# EAGLE schematic cerebellar (EAGLE 9.6.2)
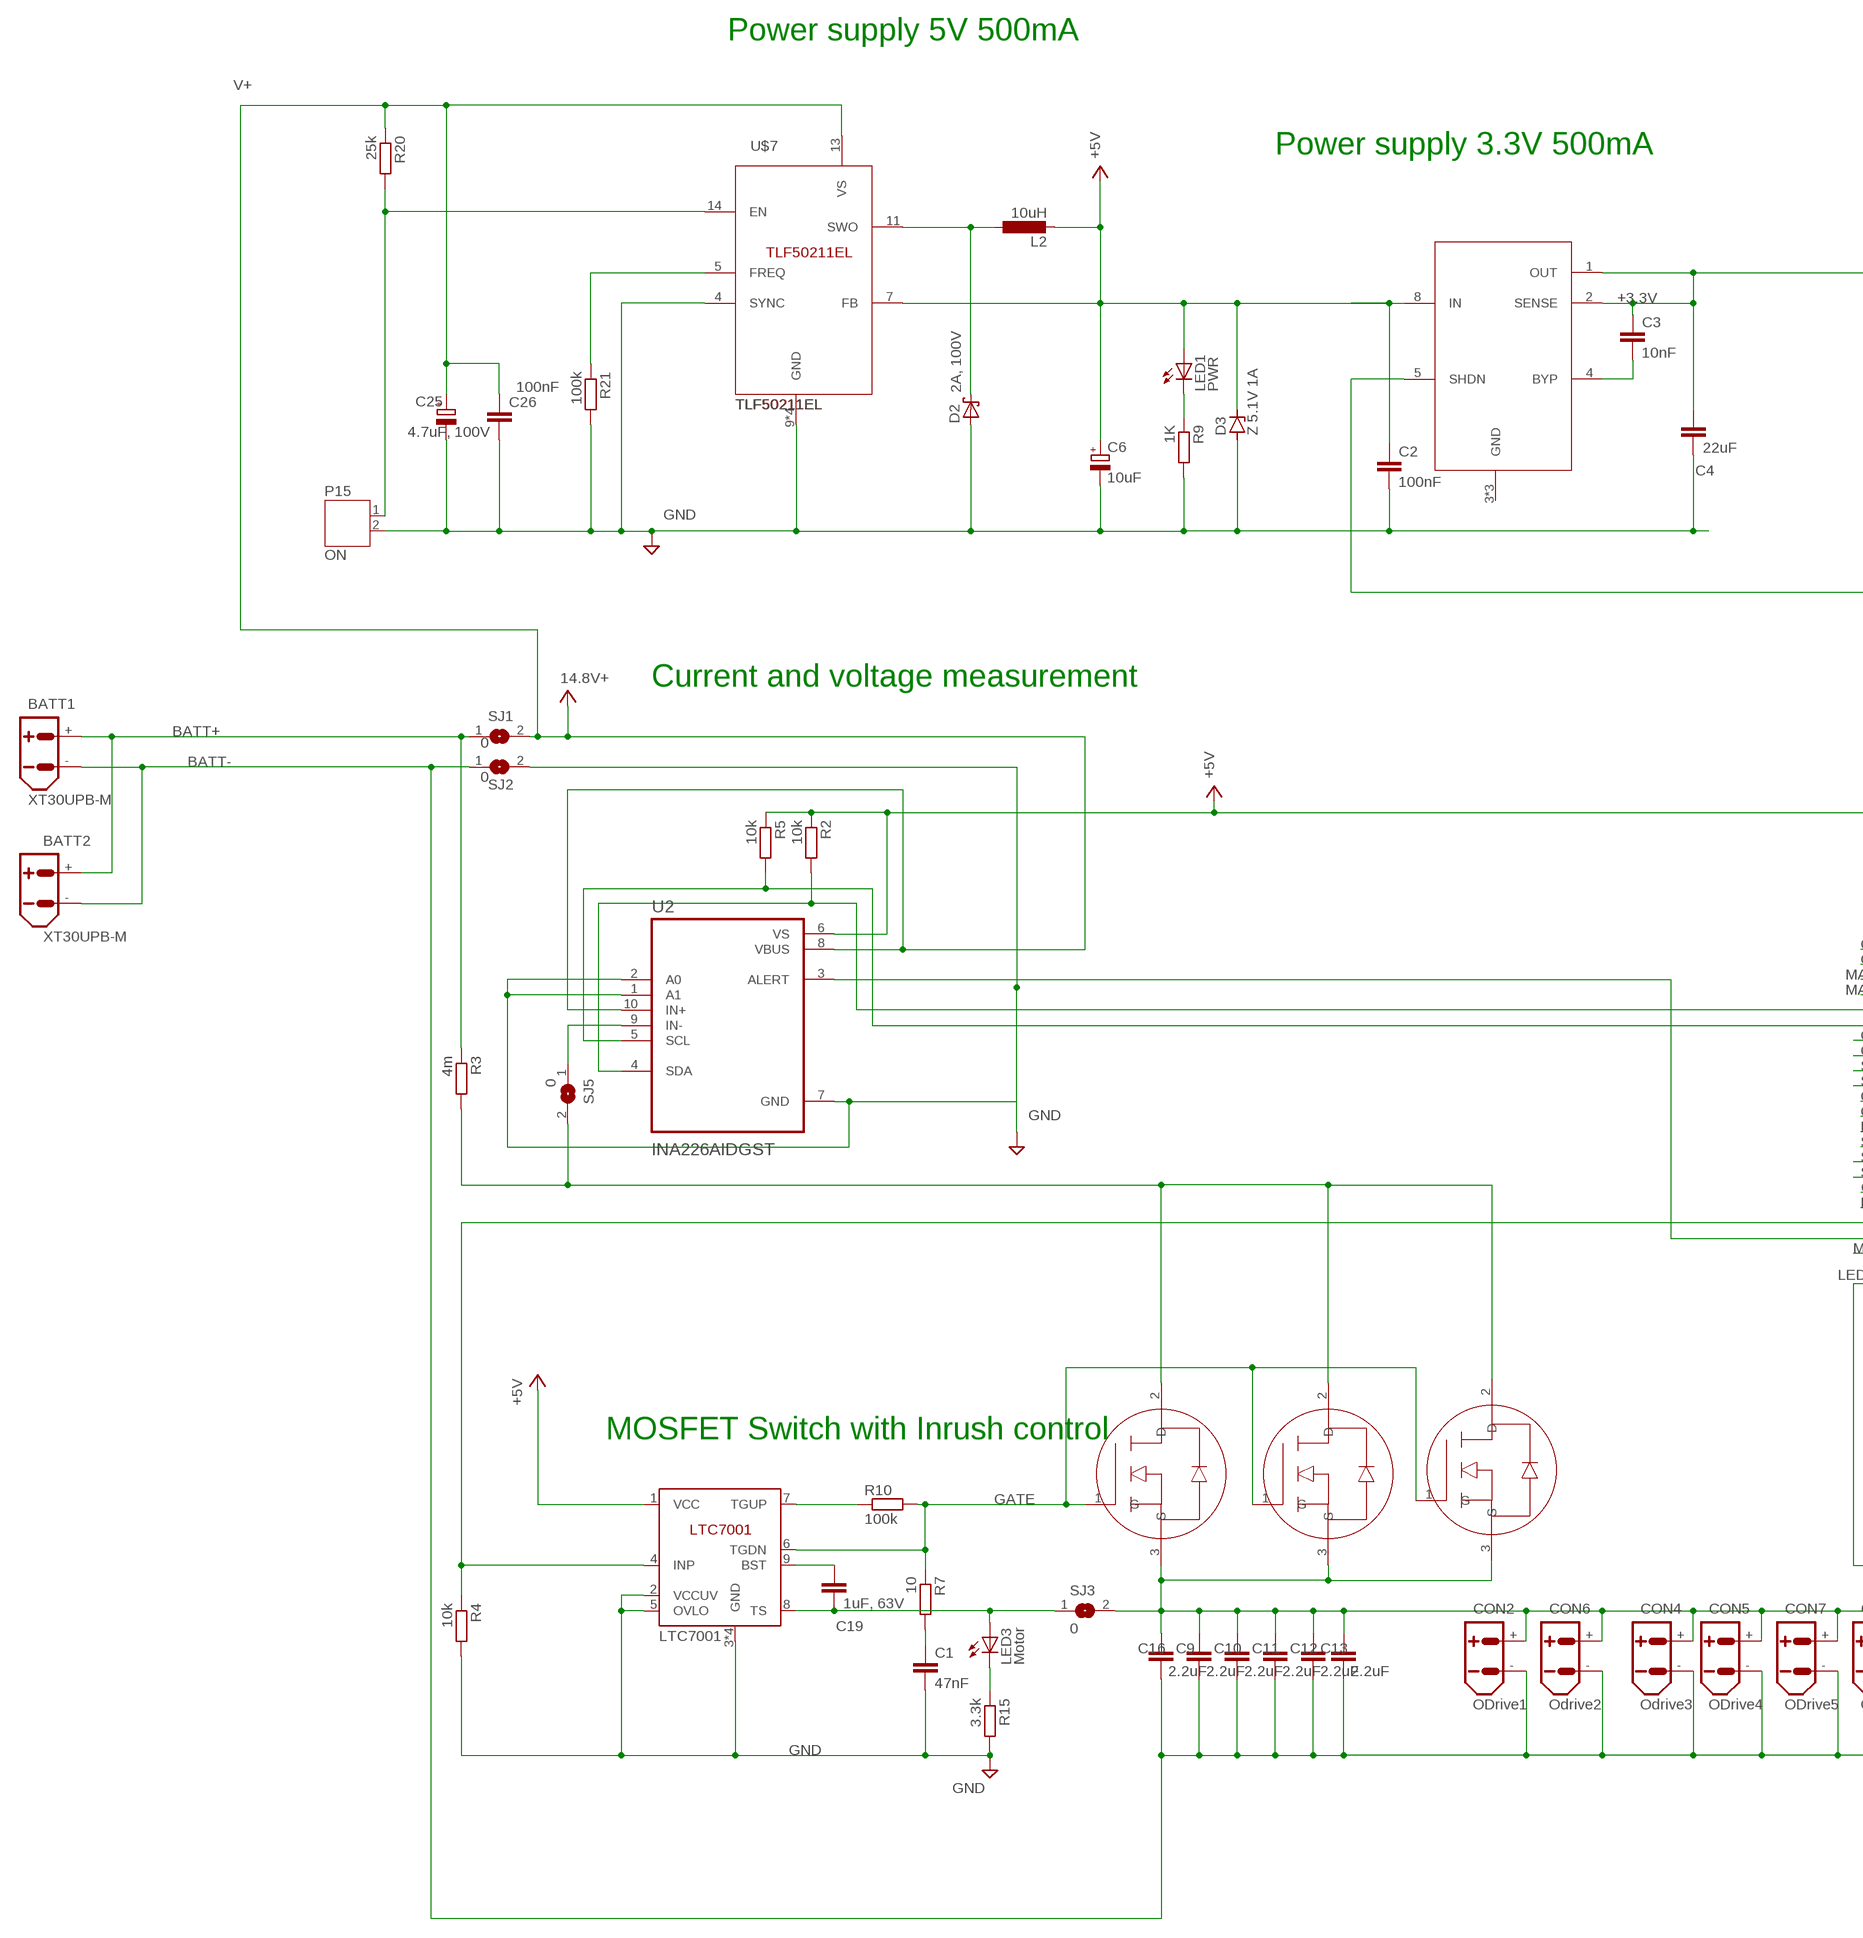
[diagram p0: schematic, sheet 1, part 1 of 2]
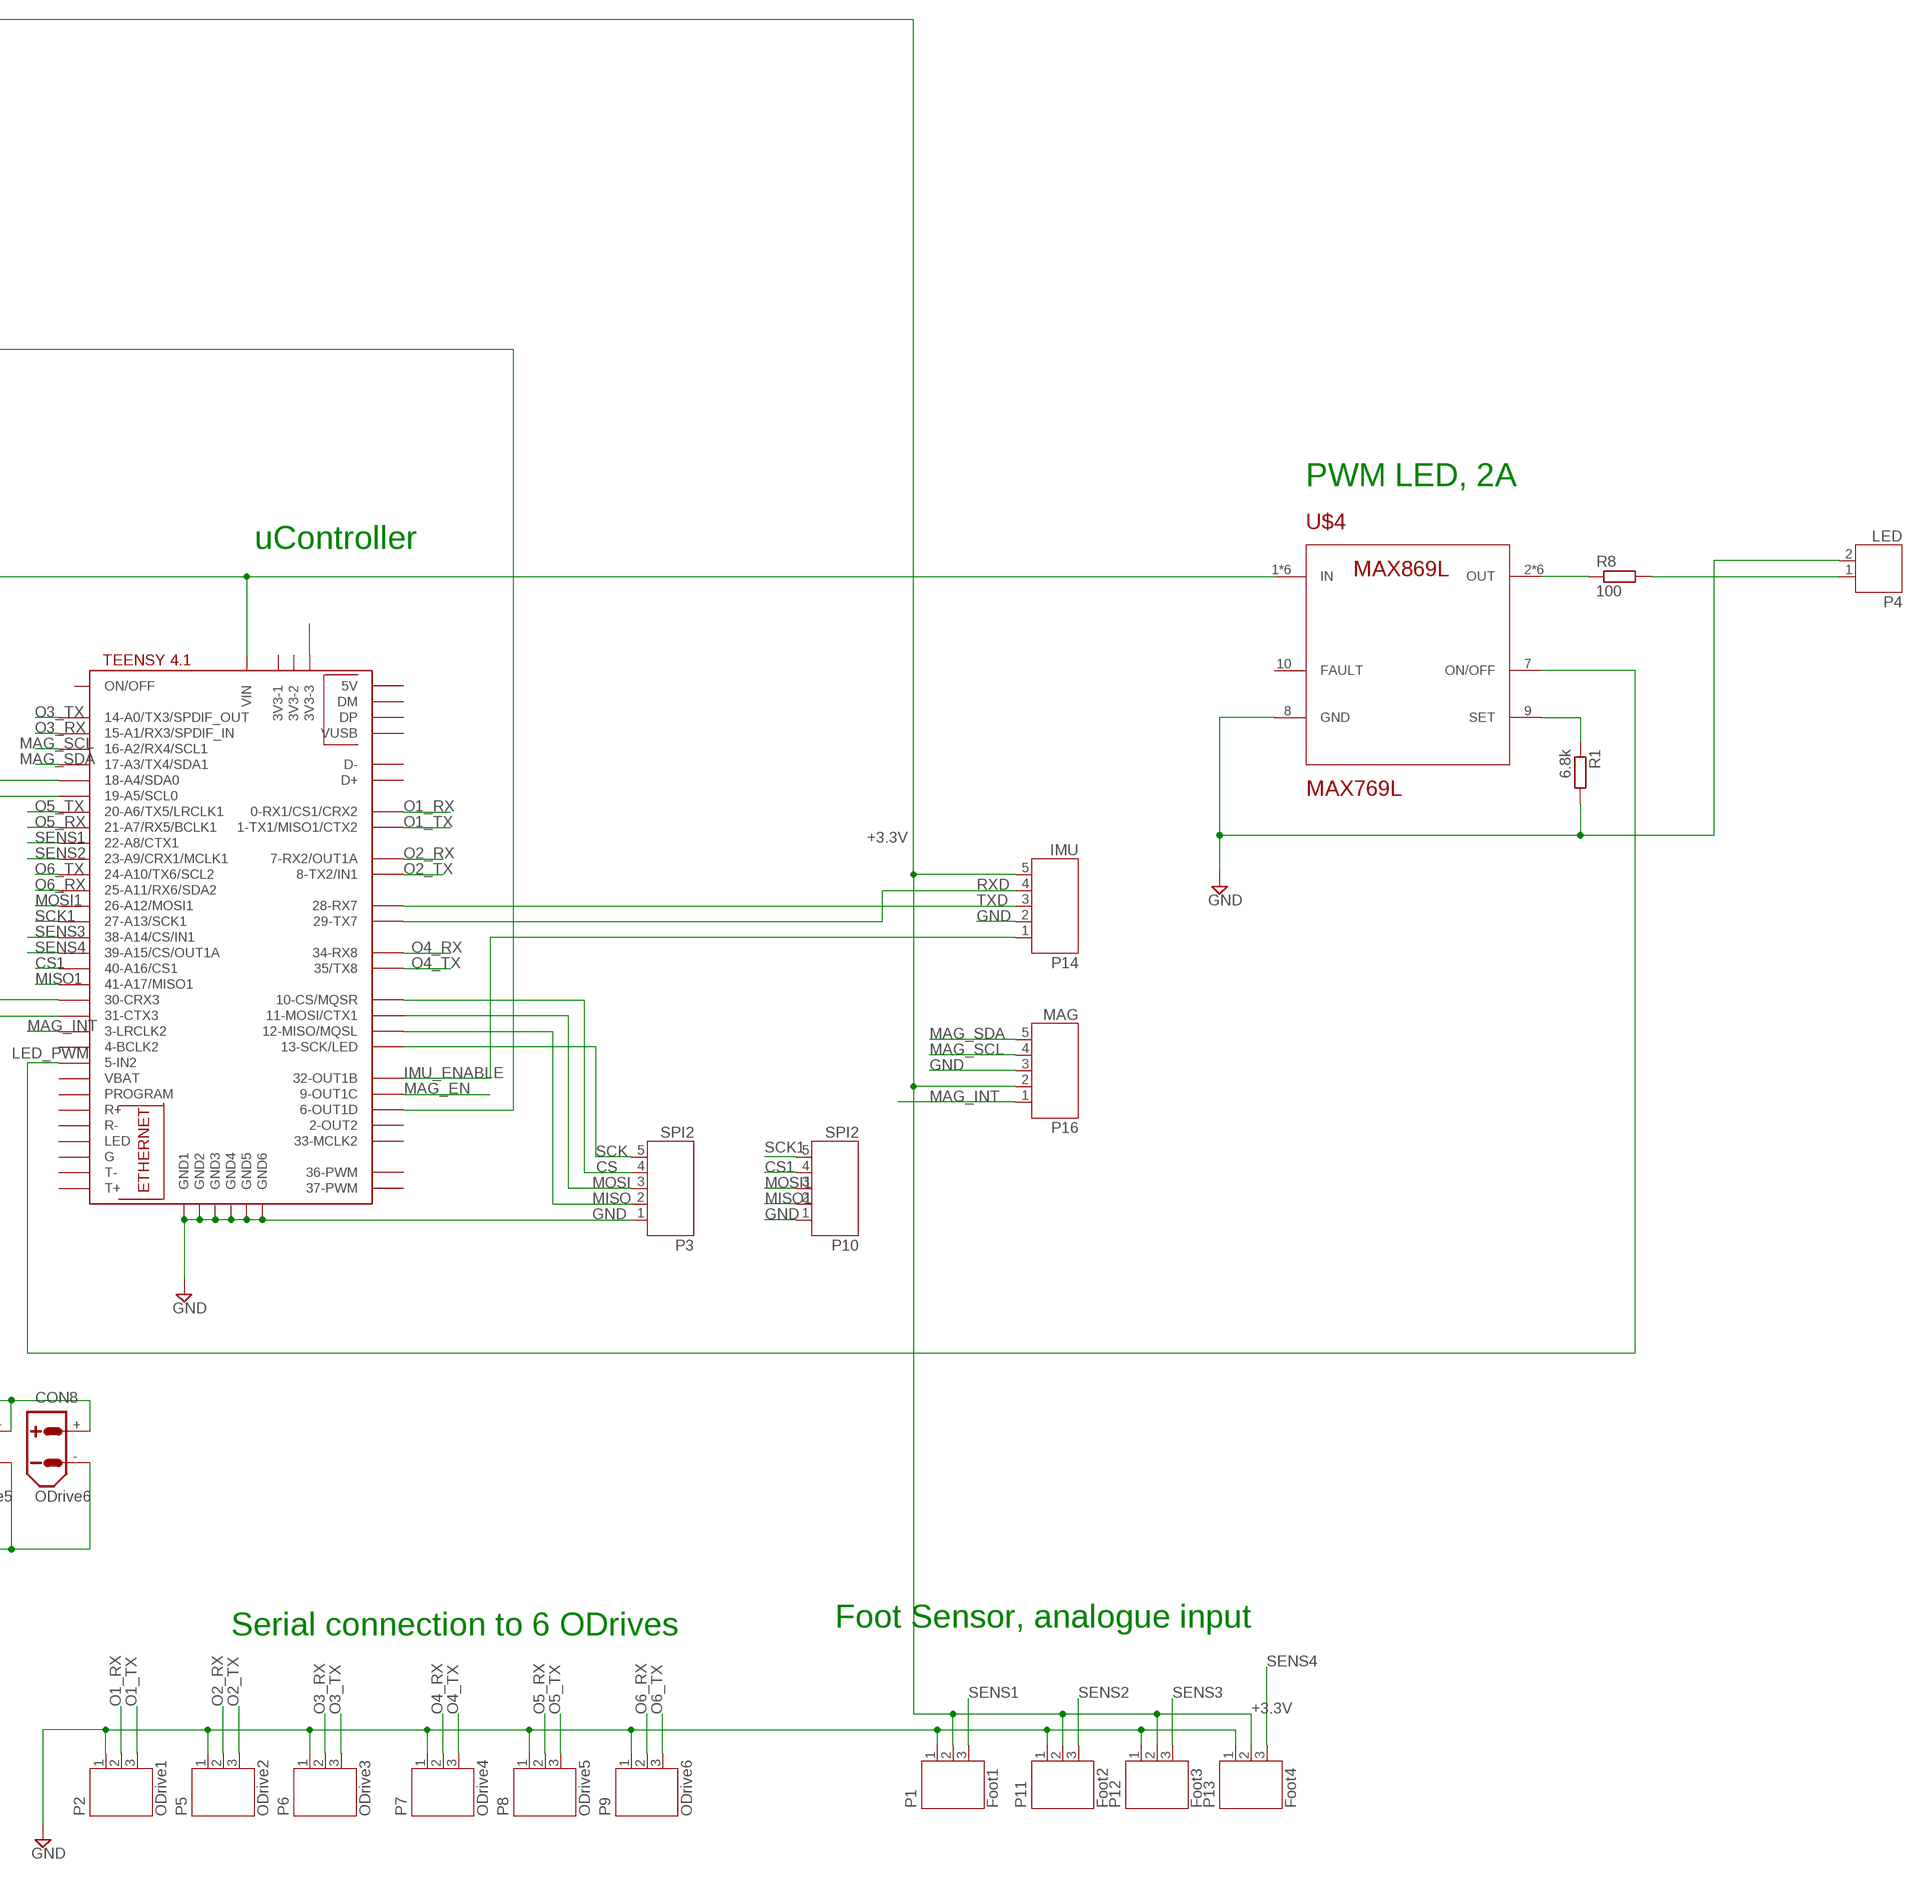
[diagram p1: schematic, sheet 1, part 2 of 2]

## Parts
BATT1  XT30UPB-M  [XT30UPB-M]
BATT2  XT30UPB-M  [XT30UPB-M]
C1  47nF  C-EU025-025X050  [C025-025X050]
C2  100nF  C-EU025-025X050  [C025-025X050]
C3  10nF  C-EU025-025X050  [C025-025X050]
C4  22uF  C-EU025-025X050  [C025-025X050]
C6  10uF  CPOL-EUE2-4  [E2-4]
C9  2.2uF  C-EU050-024X044  [C050-024X044]
C10  2.2uF  C-EU050-024X044  [C050-024X044]
C11  2.2uF  C-EU050-024X044  [C050-024X044]
C12  2.2uF  C-EU050-024X044  [C050-024X044]
C13  2.2uF  C-EU050-024X044  [C050-024X044]
C16  2.2uF  C-EU050-024X044  [C050-024X044]
C19  1uF, 63V  C-EU025-025X050  [C025-025X050]
C25  4.7uF, 100V  CPOL-EUE2-4  [E2-4]
C26  100nF  C-EU050-024X044  [C050-024X044]
CON2  ODrive1  XT30UPB-M  [XT30UPB-M]
CON4  Odrive3  XT30UPB-M  [XT30UPB-M]
CON5  ODrive4  XT30UPB-M  [XT30UPB-M]
CON6  Odrive2  XT30UPB-M  [XT30UPB-M]
CON7  ODrive5  XT30UPB-M  [XT30UPB-M]
CON8  ODrive6  XT30UPB-M  [XT30UPB-M]
D2  2A, 100V  SCHOTTKY-DIODEDO41  [DO41-10]
D3  Z 5.1V 1A  ZENER-DIODEDO41Z10  [DO41Z10]
IC3  LTC7001  [MSOP10]
L2  10uH  L-EUIRF-3  [IRF-3]
LED1  PWR  LED3MM  [LED3MM]
LED3  Motor  LED3MM  [LED3MM]
P1  Foot1  JST-PH3  [JST-PH3]
P2  ODrive1  JST-PH3  [JST-PH3]
P3  SPI2  JST-PH5  [JST-PH5]
P4  LED  JST-PH2  [JST-PH2]
P5  ODrive2  JST-PH3  [JST-PH3]
P6  ODrive3  JST-PH3  [JST-PH3]
P7  ODrive4  JST-PH3  [JST-PH3]
P8  ODrive5  JST-PH3  [JST-PH3]
P9  ODrive6  JST-PH3  [JST-PH3]
P10  SPI2  JST-PH5  [JST-PH5]
P11  Foot2  JST-PH3  [JST-PH3]
P12  Foot3  JST-PH3  [JST-PH3]
P13  Foot4  JST-PH3  [JST-PH3]
P14  IMU  JST-PH5  [JST-PH5]
P15  ON  JST-PH2  [JST-PH2]
P16  MAG  JST-PH5  [JST-PH5]
R1  6.8k  R-EU_0204/7  [0204/7]
R2  10k  R-EU_0204/7  [0204/7]
R3  4m  R-EU_R2512  [R2512]
R4  10k  R-EU_0204/7  [0204/7]
R5  10k  R-EU_0204/7  [0204/7]
R7  10  R-EU_0204/7  [0204/7]
R8  100  R-EU_0204/7  [0204/7]
R9  1K  R-EU_0204/7  [0204/7]
R10  100k  R-EU_0204/7  [0204/7]
R15  3.3k  R-EU_0204/7  [0204/7]
R20  25k  R-EU_0204/7  [0204/7]
R21  100k  R-EU_0204/7  [0204/7]
SJ1  0  SJ  [SJ]
SJ2  0  SJ  [SJ]
SJ3  0  SJ  [SJ]
SJ5  0  SJ  [SJ]
U2  INA226AIDGST  [SOP50P490X110-10N]
U$1  TEENSY41  [TEENSY41]
U$2  IRF2804  [TO-220H]
U$3  IRF2804  [TO-220H]
U$4  MAX769L  [TSSOP-16]
U$5  IRF2804  [TO-220H]
U$7  TLF50211EL  [TSSOP-14]
U$8  LT1763  [SO08]

## Nets
+3.3V: C3.1 C4.1 P1.2 P11.2 P12.2 P13.2 P14.5 P16.2 U$8.1(OUT) U$8.2(SENSE)
+5V: C2.1 C6.+ D3.C IC3.1(VCC) L2.2 LED1.A R2.1 R5.1 U2.6(VS) U$1.VIN U$4.1(IN) U$4.4(IN) U$4.5(IN) U$4.12(IN) U$4.13(IN) U$4.16(IN) U$7.7(FB) U$8.8(IN)
BATT+ [Battery]: BATT1.+ BATT2.+ R3.1 SJ1.1
BATT- [Battery]: BATT1.- BATT2.- C9.2 C10.2 C11.2 C12.2 C13.2 C16.2 CON2.- CON4.- CON5.- CON6.- CON7.- CON8.- SJ2.1
CS: P3.4 U$1.10-CS\MQSR(10-CS/MQSR)
CS1: P10.4 U$1.40-A16/CS1
DRAIN [Battery]: R3.2 SJ5.2 U$2.2(D) U$3.2(D) U$5.2(D)
GATE: IC3.6(TGDN) R7.1 R10.2 U$2.1(G) U$3.1(G) U$5.1(G)
GND: C1.2 C2.2 C4.2 C6.- C25.- C26.2 D2.A D3.A IC3.2(VCCUV) IC3.3(GND) IC3.5(OVLO) IC3.10(GND) IC3.11(GND) IC3.12(GND) P1.1 P2.1 P3.1 P4.2 P5.1 P6.1 P7.1 P8.1 P9.1 P10.1 P11.1 P12.1 P13.1 P14.2 P15.2 P16.3 R1.2 R4.2 R9.2 R15.2 R21.2 SJ2.2 U2.1(A1) U2.2(A0) U2.7(GND) U$1.GND1 U$1.GND2 U$1.GND3 U$1.GND4 U$1.GND5 U$1.GND6 U$4.8(GND) U$7.4(SYNC) U$7.9(GND) U$7.10(GND) U$7.15(GND) U$7.16(GND)
IMU_ENABLE: P14.1 U$1.32-OUT1B
LED_PWM: U$1.5-IN2 U$4.7(ON/OFF)
MAG_EN: U$1.9-OUT1C
MAG_INT: P16.1 U$1.3-LRCLK2
MAG_SCL: P16.4 U$1.16-A2/RX4/SCL1
MAG_SDA: P16.5 U$1.17-A3/TX4/SDA1
MISO: P3.2 U$1.12-MISO/MQSL
MISO1: P10.2 U$1.41-A17/MISO1
MOSI: P3.3 U$1.11-MOSI/CTX1
MOSI1: P10.3 U$1.26-A12/MOSI1
N$1: C1.1 R7.2
N$2: R1.1 U$4.9(SET)
N$3: P4.1 R8.2
N$4: IC3.7(TGUP) R10.1
N$5: U2.3(ALERT) U$1.31-CTX3
N$6: R8.1 U$4.2(OUT) U$4.3(OUT) U$4.6(OUT) U$4.11(OUT) U$4.14(OUT) U$4.15(OUT)
N$7: U$1.3V3-3
N$8: C3.2 U$8.4(BYP)
N$9: U$1.6-OUT1D U$8.5(SHDN)
N$10: IC3.4(INP) R4.1 U$1.30-CRX3
N$17: R5.2 U2.5(SCL) U$1.19-A5/SCL0
N$18: SJ5.1 U2.9(IN-)
N$22: R2.2 U2.4(SDA) U$1.18-A4/SDA0
N$24: C19.1 IC3.9(BST)
N$26: C19.2 IC3.8(TS) LED3.A SJ3.1
N$30: LED3.K(C) R15.1
N$39: LED1.K(C) R9.1
N$42: D2.C L2.1 U$7.11(SWO)
N$46: R21.1 U$7.5(FREQ)
N$47: P15.1 R20.2 U$7.14(EN)
O1_RX: P2.2 U$1.0-RX1/CS1/CRX2
O1_TX: P2.3 U$1.1-TX1/MISO1/CTX2
O2_RX: P5.2 U$1.7-RX2/OUT1A
O2_TX: P5.3 U$1.8-TX2/IN1
O3_RX: P6.2 U$1.15-A1/RX3/SPDIF_IN
O3_TX: P6.3 U$1.14-A0/TX3/SPDIF_OUT
O4_RX: P7.2 U$1.34-RX8
O4_TX: P7.3 U$1.35-TX8(35/TX8)
O5_RX: P8.2 U$1.21-A7/RX5/BCLK1
O5_TX: P8.3 U$1.20-A6/TX5/LRCLK1
O6_RX: P9.2 U$1.25-A11/RX6/SDA2
O6_TX: P9.3 U$1.24-A10/TX6/SCL2
POWER+ [Battery]: C9.1 C10.1 C11.1 C12.1 C13.1 C16.1 CON2.+ CON4.+ CON5.+ CON6.+ CON7.+ CON8.+ SJ3.2 U$2.3(S) U$3.3(S) U$5.3(S)
RXD: P14.4 U$1.29-TX7
SCK: P3.5 U$1.13-SCK/LED
SCK1: P10.5 U$1.27-A13/SCK1
SENS1: P1.3 U$1.22-A8/CTX1
SENS2: P11.3 U$1.23-A9/CRX1/MCLK1
SENS3: P12.3 U$1.38-A14/CS/IN1
SENS4: P13.3 U$1.39-A15/CS/OUT1A
TXD: P14.3 U$1.28-RX7
V+: C25.+ C26.1 R20.1 SJ1.2 U2.8(VBUS) U2.10(IN+) U$7.13(VS) ; supply symbol labelled 14.8V+
Unconnected: U$1.2-OUT2 U$1.3V3-1 U$1.3V3-2 U$1.4-BCLK2 U$1.33-MCLK2 U$1.36-PWM U$1.37-PWM U$1.+5V(5V) U$1.D+ U$1.D- U$1.DM U$1.DP U$1.G U$1.LED U$1.ON/OFF U$1.PROGRAM U$1.R+ U$1.R- U$1.T+ U$1.T- U$1.VBAT U$1.VUSB U$4.10(FAULT) U$8.3(GND) U$8.6(GND) U$8.7(GND)

## Notes on the sheet
- Power supply 5V 500mA
- Power supply 3.3V 500mA
- Current and voltage measurement
- PWM LED, 2A
- uController
- MOSFET Switch with Inrush control
- Serial connection to 6 ODrives | Foot Sensor, analogue input

## Library data of the parts
BATT1 BATT2 CON2 CON4-CON8 = amass:XT30: AMASS XT30 connector Store in Japan AMASS XT30 connector <https://szc.jp/ams-xt30>
C1-C4 C9-C13 C16 C19 C26 = rcl:C-EU: CAPACITOR, European symbol; SPICEPREFIX: C
C6 C25 = rcl:CPOL-EU: POLARIZED CAPACITOR, European symbol; SPICEPREFIX: C
D2 = adafruit:SCHOTTKY-DIODE: Schottky Diode
D3 = diode:ZENER-DIODE: Z-Diode
IC3 = LTC7001:LTC7001: Fast 150V High Side NMOS Static Switch Driver Source: https://www.analog.com/en/products/ltc7001.html; MPN: AD7992BRMZ-0; OC_FARNELL: 1078311; OC_NEWARK: 31M4422
L2 = rcl:L-EU: INDUCTOR, European symbol; SPICEPREFIX: L
LED1 LED3 = adafruit:LED: LED OSRAM: - CHIPLED LG R971, LG N971, LY N971, LG Q971, LY Q971, LO R971, LY R971 LH N974, LH R974 LS Q976, LO Q976, LY Q976 LO Q996 - Hyper CHIPLED LW Q18S LB Q993, LB Q99A, LB R99A - SideLED LS A670, LO A670, LY A670, LG A670, LP A670 LB A673, LV A673, LT A673, LW A673 LH A674 LY A675 LS A676, LA A676, LO A676, LY A676, LW A676 LS A679, LY A679, LG A679 - Hyper Micro SIDELED® LS Y876, LA Y876, LO Y876, LY Y876 LT Y87S - SmartLED LW L88C, LW L88S LB L89C, LB L89S, LG L890 LS L89K, LO L89K, LY L89K LS L896, LA L896, LO L896, LY L896 - TOPLED LS T670, LO T670, LY T670, LG T670, LP T670 LSG T670, LSP T670, LSY T670, LOP T670, LYG T670 LG T671, LOG T671, LSG T671 LB T673, LV T673, LT T673, LW T673 LH T674 LS T676, LA T676, LO T676, LY T676, LB T676, LH T676, LSB T676, LW T676 LB T67C, LV T67C, LT T67C, LS T67K, LO T67K, LY T67K, LW E67C LS E67B, LA E67B, LO E67B, LY E67B, LB E67C, LV E67C, LT E67C LW T67C LS T679, LY T679, LG T679 LS T770, LO T770, LY T770, LG T770, LP T770 LB T773, LV T773, LT T773, LW T773 LH T774 LS E675, LA E675, LY E675, LS T675 LS T776, LA T776, LO T776, LY T776, LB T776 LHGB T686 LT T68C, LB T68C - Hyper Mini TOPLED® LB M676 - Mini TOPLED Santana® LG M470 LS M47K, LO M47K, LY M47K Source: http://www.osram.convergy.de/
P1 P2 P5-P9 P11-P13 = jst-ph:JST-PH3
P3 P10 P14 P16 = jst-ph:JST-PH5
P4 P15 = jst-ph:JST-PH2
R1 R2 R4 R5 R7-R10 R15 R20 R21 = rcl:R-EU_: RESISTOR, European symbol; SPICEPREFIX: R
R3 = rcl:R-EU_: RESISTOR, European symbol; DIGIKEY: 541-WSK25124L000FEACT-ND; LINK: https://octopart.com/wsk25124l000fea-vishay-41934978?r=sp; MOUSER: 71-WSK25124L000FEA; SPICEPREFIX: R
SJ1-SJ3 SJ5 = jumper:SJ: SMD solder JUMPER
U2 = INA226AIDGST:INA226AIDGST: Check availability <https://pricing.snapeda.com/parts/INA226AIDGST/Texas%20Instruments/view-part?ref=eda>; AVAILABILITY: In Stock; DESCRIPTION: 36V, 16-bit, ultra-precise i2c output current/voltage/power monitor w/alert; MF: Texas Instruments; MP: INA226AIDGST; PACKAGE: VSSOP-10 Texas Instruments; PRICE: None; PURCHASE-URL: https://pricing.snapeda.com/search/part/INA226AIDGST/?ref=eda
U$1 = teensy:TEENSY41
U$2 U$3 U$5 = IRF2804:IRF2804: N-Channel Power MOSFET
U$4 = MAX869:MAX769L: MAX869L 2A, Current-Limited, High-Side P-Channel Switch with Thermal Shutdown
U$7 = TLF50211EL:TLF50211EL: TLF50211EL 2.2 MHz Step-Down Regulator 500 mA, 5 V, low quiescent current https://www.infineon.com/dgdl/Infineon-TLF50211EL-DS-v01_10-EN.pdf?fileId=5546d46258fc0bc1015969d2af9641e9
U$8 = LT1763:LT1763

## Net classes
0 default: width 0.254 mm
1 Battery: width 1.575 mm